# EAGLE design VF_4Channel_ResistanceMixer (EAGLE 9.6.2)
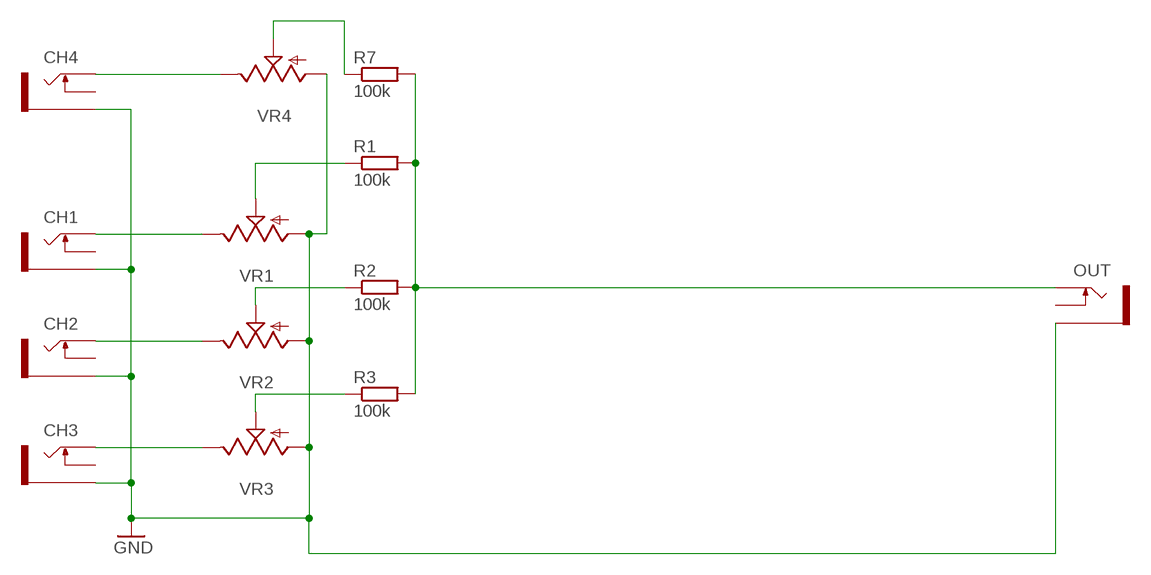
[diagram p0: schematic, sheet 1]

## Parts
CH1  THONKICONNNEW  [WQP-PJ301M-12_JACK]
CH2  THONKICONNNEW  [WQP-PJ301M-12_JACK]
CH3  THONKICONNNEW  [WQP-PJ301M-12_JACK]
CH4  THONKICONNNEW  [WQP-PJ301M-12_JACK]
OUT  THONKICONNNEW  [WQP-PJ301M-12_JACK]
R1  100k  RESISTOR7MM  [7MM_RESISTOR]
R2  100k  RESISTOR7MM  [7MM_RESISTOR]
R3  100k  RESISTOR7MM  [7MM_RESISTOR]
R7  100k  RESISTOR7MM  [7MM_RESISTOR]
VR1  9MM_SNAP-IN_POT_  [9MM_SNAP-IN_POT]
VR2  9MM_SNAP-IN_POT_  [9MM_SNAP-IN_POT]
VR3  9MM_SNAP-IN_POT_  [9MM_SNAP-IN_POT]
VR4  9MM_SNAP-IN_POT_  [9MM_SNAP-IN_POT]

## Nets
GND: CH1.P$3_SLEEVE(SLEEVE) CH2.P$3_SLEEVE(SLEEVE) CH3.P$3_SLEEVE(SLEEVE) CH4.P$3_SLEEVE(SLEEVE) OUT.P$3_SLEEVE(SLEEVE) VR1.1(A) VR2.1(A) VR3.1(A) VR4.1(A)
N$2: CH3.P$1_TIP(TIP) VR3.3(E)
N$3: CH2.P$1_TIP(TIP) VR2.3(E)
N$4: CH1.P$1_TIP(TIP) VR1.3(E)
N$5: R3.1 VR3.2(S)
N$6: R2.1 VR2.2(S)
N$7: R1.1 VR1.2(S)
N$9: CH4.P$1_TIP(TIP) VR4.3(E)
N$11: OUT.P$1_TIP(TIP) R1.2 R2.2 R3.2 R7.2
N$17: R7.1 VR4.2(S)
Unconnected: CH1.P$2_SWITCH(SWITCH) CH2.P$2_SWITCH(SWITCH) CH3.P$2_SWITCH(SWITCH) CH4.P$2_SWITCH(SWITCH) OUT.P$2_SWITCH(SWITCH)

## Library data of the parts
CH1-CH4 OUT = MusicThingModular:THONKICONN: 3.5mm socket for Eurorack modular synths
R1-R3 R7 = MusicThingModular:RESISTOR: Standard resistor, various versions
VR1-VR4 = MusicThingModular:9MM_SNAP-IN_POT: 9mm vertical snap-in pot, Alpha / Panasonic style

## Net classes
1 power: width 0.61 mm

## Board
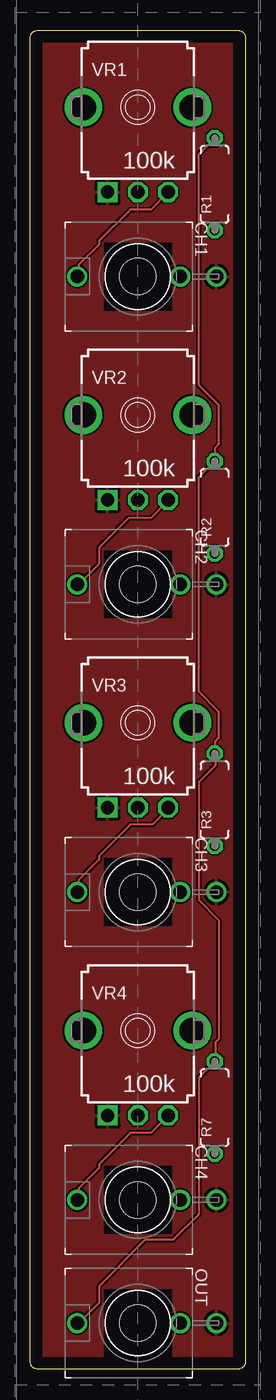
[diagram p1: board, top side]
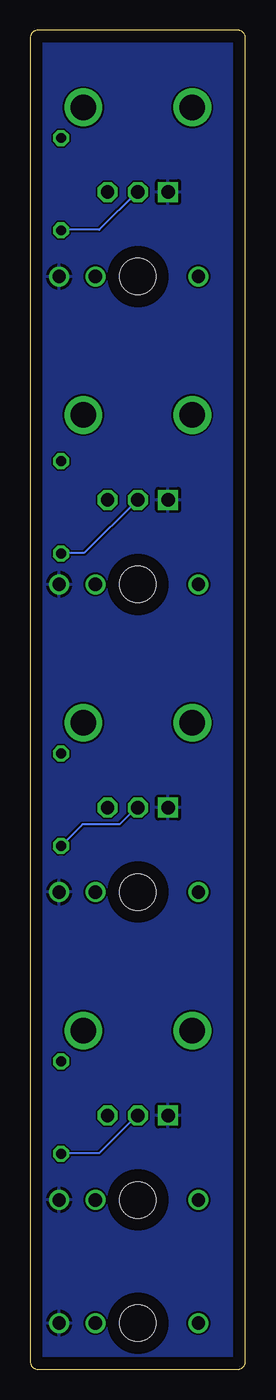
[diagram p2: board, bottom side, seen from below]

Size 17.78 x 110.49 mm. Coordinates in mm from the lower left corner, seen from the top.
Copper layers (1*16): Top 0.035mm / dielectric 1.5mm / Bottom 0.035mm
Design rules "default": minimum track width 6mil, minimum drill 0.35mm, track to track 6mil, track to pad 6mil, pad to pad 6mil, via to via 6mil, smd to smd 6mil, copper to edge 40mil, drill to drill 6mil, minimum pad ring 10mil, minimum via ring 8mil, stop-mask expansion 4mil, vias tented up to drill 0mil, thermal gap 10mil
Holes 3 mm at 8.89,90.17 8.89,64.77 8.89,39.37 8.89,13.97 8.89,3.81

### Footprints (pad centres in the part's own frame; a part is rotated, then mirrored left to right if it is on the bottom)
WQP-PJ301M-12_JACK = drill 1.1: P$1_TIP 0,5; P$2_SWITCH 0,-3.5; P$3_SLEEVE 0,-6.5
7MM_RESISTOR = drill 0.813 octagon: 1 -3.81,0; 2 3.81,0
9MM_SNAP-IN_POT = drill 1.1 square: 1 -2.5,-7 | drill 1.1 octagon: 2 0,-7; 3 2.5,-7 | drill 2.1 pad 2.794: CHASSIS1 -4.5,0; CHASSIS2 4.5,0

### Placement (x,y rotation side)
CH1  8.89,90.17 90 top
CH2  8.89,64.77 90 top
CH3  8.89,39.37 90 top
CH4  8.89,13.97 90 top
OUT  8.89,3.81 90 top
R1  15.24,97.79 90 top
R2  15.24,71.12 90 top
R3  15.24,46.99 90 top
R7  15.24,21.59 90 top
U$2  [EURO_PCB_4HP]  -1.27,-8.89 0 top  (outside the outline)
VR1  8.89,104.14 0 top
VR2  8.89,78.74 0 top
VR3  8.89,53.34 0 top
VR4  8.89,27.94 0 top

### Tracks (layer width: path | path; a pad name or v marks a point on that pad's centre or on a via)
GND
  pour Top: -1.27,110.49 19.05,110.49 19.05,0 -1.27,0
  pour Bottom: 0,110.49 17.78,110.49 17.78,0 1.27,0 0,0
N$2
  Top 0.152: CH3.P$1_TIP 4.01,39.47 4.01,40.39 5.69,42.06 5.69,42.37 8.28,44.96 10.11,44.96 11.48,46.33 VR3.3
N$3
  Top 0.152: CH2.P$1_TIP 4.01,64.77 5.69,66.45 5.69,67.82 8.13,70.26 9.96,70.26 11.33,71.63 VR2.3
N$4
  Top 0.152: CH1.P$1_TIP 4.01,90.22 4.01,91.14 5.69,92.81 5.69,93.12 8.28,95.71 9.96,95.71 11.33,97.08 VR1.3
N$5
  Bottom 0.152: R3.1 13.46,44.96 10.41,44.96 8.89,46.48 VR3.2
N$6
  Bottom 0.152: R2.1 15.14,67.36 13.31,67.36 8.89,71.78 VR2.2
N$7
  Bottom 0.152: R1.1 15.14,94.03 12.09,94.03 8.89,97.23 VR1.2
N$9
  Top 0.152: CH4.P$1_TIP 4.01,14.02 4.01,14.93 5.69,16.61 5.69,16.92 8.28,19.51 9.96,19.51 11.33,20.88 VR4.3
N$11
  Top 0.152: R1.2 13.92,100.28 13.92,81.23 15.6,79.55 15.6,76.35 15.29,76.05 15.29,74.98 R2.2 13.92,73.61 13.92,55.93 15.6,54.25 15.6,52.12 15.29,51.82 15.29,50.9 R3.2 15.29,50.75 15.29,49.83 13.92,48.46 13.92,38.71 15.6,37.03 15.6,27.28 15.29,26.98 15.29,25.45 R7.2 13.92,24.08 13.92,12.8 11.79,10.67 9.5,10.67 5.69,6.86 5.69,5.49 4.01,3.81 OUT.P$1_TIP
N$17
  Bottom 0.152: R7.1 15.14,17.83 12.09,17.83 8.89,21.03 VR4.2

### Text on the board
tPlace: 100k | 100k | 100k | 100k